# Altium schematic sheet ECU_Sheet2.SchDoc
size A3
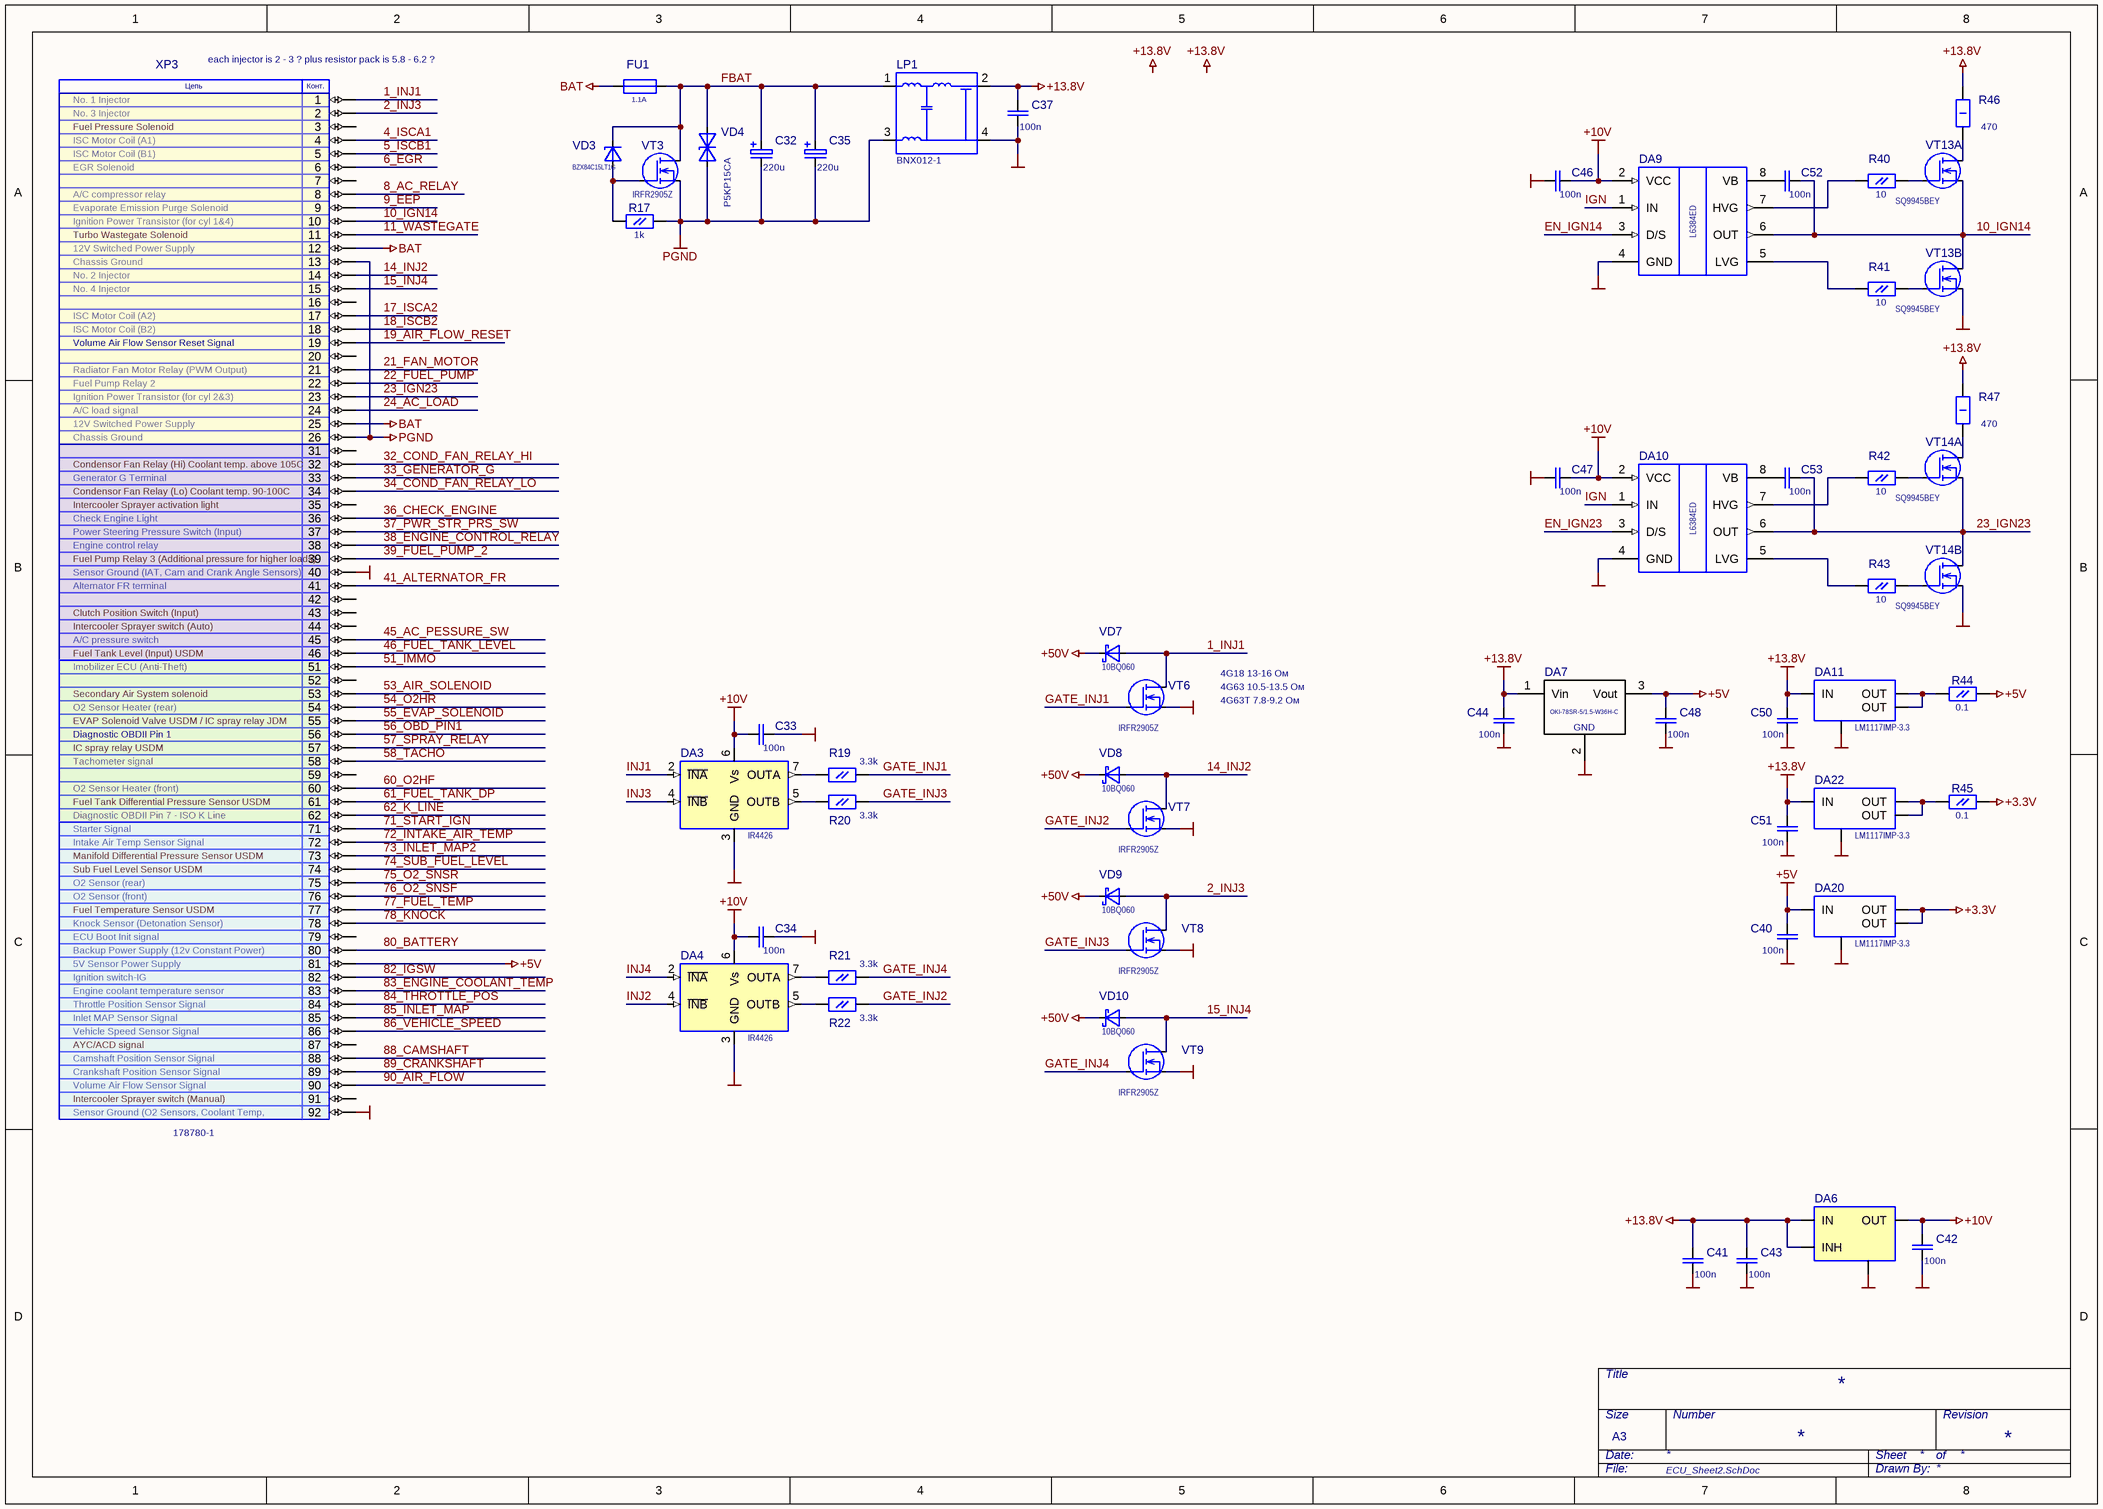
[diagram p0: ECU_Sheet2.SchDoc]

## Parts
C32  value 220u  [C_D_POL]  (hidden comment: CTANT)
C33  value 100n  [C0805L]  (hidden comment: CSMD)
C34  value 100n  [C0805L]  (hidden comment: CSMD)
C35  value 220u  [C_D_POL]  (hidden comment: CTANT)
C37  value 100n  [C0805L]  (hidden comment: 0.1мкФ-25В-X8R-10%)
C40  value 100n  [C0805L]  (hidden comment: CSMD)
C41  value 100n  [C0805L]  (hidden comment: 0.1мкФ-25В-X8R-10%)
C42  value 100n  [C0805L]  (hidden comment: 0.1мкФ-25В-X8R-10%)
C43  value 100n  [C0805L]  (hidden comment: 0.1мкФ-25В-X8R-10%)
C44  value 100n  [C0805L]  (hidden comment: CSMD)
C46  value 100n  [C0805L]  (hidden comment: CSMD)
C47  value 100n  [C0805L]  (hidden comment: CSMD)
C48  value 100n  [C0805L]  (hidden comment: CSMD)
C50  value 100n  [C0805L]  (hidden comment: CSMD)
C51  value 100n  [C0805L]  (hidden comment: CSMD)
C52  value 100n  [C0805L]  (hidden comment: CSMD)
C53  value 100n  [C0805L]  (hidden comment: CSMD)
DA3  IR4426  [SOIC8 JEDEC]
DA4  IR4426  [SOIC8 JEDEC]
DA6  TLE4266GS V10  [SOT-223]  (value not drawn)
DA7  OKI-78SR-5/1.5-W36H-C  [OKI-78SR-H]
DA9  L6384ED  [SOIC8 JEDEC]
DA10  L6384ED  [SOIC8 JEDEC]
DA11  LM1117IMP-3.3  [SOT-223]
DA20  LM1117IMP-3.3  [SOT-223]
DA22  LM1117IMP-3.3  [SOT-223]
FU1  value 1.1A  [FUSE1206]  (hidden comment: MF-NSMF110)
LP1  BNX012-1  [BNX012-01]
R17  value 1k  [R0805L]  (hidden comment: 1к-5%)
R19  value 3.3k  [R0603L]  (hidden comment: RSMD)
R20  value 3.3k  [R0603L]  (hidden comment: RSMD)
R21  value 3.3k  [R0603L]  (hidden comment: RSMD)
R22  value 3.3k  [R0603L]  (hidden comment: RSMD)
R40  value 10  [R0603L]  (hidden comment: RSMD)
R41  value 10  [R0603L]  (hidden comment: RSMD)
R42  value 10  [R0603L]  (hidden comment: RSMD)
R43  value 10  [R0603L]  (hidden comment: RSMD)
R44  value 0.1  [R0805L]  (hidden comment: 1к-5%)
R45  value 0.1  [R0805L]  (hidden comment: 1к-5%)
R46  value 470  [R2512]  (hidden comment: R2512)
R47  value 470  [R2512]  (hidden comment: R2512)
VD3  BZX84C15LT1G  [SOT-23]
VD4  P5KP15CA  [P600]
VD7  10BQ060  [DO-214AA SMB]
VD8  10BQ060  [DO-214AA SMB]
VD9  10BQ060  [DO-214AA SMB]
VD10  10BQ060  [DO-214AA SMB]
VT3  IRFR2905Z  [D-PAK (TO-252)]
VT6  IRFR2905Z  [D-PAK (TO-252)]
VT7  IRFR2905Z  [D-PAK (TO-252)]
VT8  IRFR2905Z  [D-PAK (TO-252)]
VT9  IRFR2905Z  [D-PAK (TO-252)]
VT13  SQ9945BEY  [SOIC8 DBL FET]  (parts A,B of 2)
VT14  SQ9945BEY  [SOIC8 DBL FET]  (parts A,B of 2)
XP3  178780-1  [MITSUBISHI_ECU_CON]

## Nets
+3.3V: DA20.2(OUT) DA20.4(OUT) R45.1(Pin1)
+5V: C40.1 C48.1 DA7.3(Vout) DA20.3(IN) R44.1(Pin1) XP3.81
+10V: C33.2 C34.2 C42.1 C46.1 C47.1 DA3.6(Vs) DA4.6(Vs) DA6.3(OUT) DA9.2(VCC) DA10.2(VCC)
+13.8V: C37.1 C41.1 C43.1 C44.1 C50.1 C51.1 DA6.1(IN) DA6.2(INH) DA7.1(Vin) DA11.3(IN) DA22.3(IN) LP1.2(CB) R46.2(Pin2) R47.2(Pin2)
+50V: VD7.2 VD8.2 VD9.2 VD10.2
BAT: FU1.1 XP3.12 XP3.25
GND: C33.1 C34.1 C37.2 C40.2 C41.2 C42.2 C43.2 C44.2 C46.2 C47.2 C48.2 C50.2 C51.2 DA3.3(GND) DA4.3(GND) DA6.4(GND) DA7.2 DA9.4(GND) DA10.4(GND) DA11.1(G) DA20.1(G) DA22.1(G) LP1.4(CG) VT6.2(S) VT7.2(S) VT8.2(S) VT9.2(S) VT13.3 VT14.3 XP3.40 XP3.92
PGND: C32.N C35.N LP1.3(PSG) R17.1(Pin1) VD4.1 VT3.2(S) XP3.13 XP3.26
1_INJ1: VD7.1 VT6.3(D) XP3.1
2_INJ3: VD9.1 VT8.3(D) XP3.2
4_ISCA1: XP3.4
5_ISCB1: XP3.5
6_EGR: XP3.6
8_AC_RELAY: XP3.8
9_EEP: XP3.9
10_IGN14: C52.1 DA9.6(OUT) VT13.1 VT13.5 XP3.10
11_WASTEGATE: XP3.11
14_INJ2: VD8.1 VT7.3(D) XP3.14
15_INJ4: VD10.1 VT9.3(D) XP3.15
17_ISCA2: XP3.17
18_ISCB2: XP3.18
19_AIR_FLOW_RESET: XP3.19
21_FAN_MOTOR: XP3.21
22_FUEL_PUMP: XP3.22
23_IGN23: C53.1 DA10.6(OUT) VT14.1 VT14.5 XP3.23
24_AC_LOAD: XP3.24
32_COND_FAN_RELAY_HI: XP3.32
33_GENERATOR_G: XP3.33
34_COND_FAN_RELAY_LO: XP3.34
36_CHECK_ENGINE: XP3.36
37_PWR_STR_PRS_SW: XP3.37
38_ENGINE_CONTROL_RELAY: XP3.38
39_FUEL_PUMP_2: XP3.39
41_ALTERNATOR_FR: XP3.41
45_AC_PESSURE_SW: XP3.45
46_FUEL_TANK_LEVEL: XP3.46
51_IMMO: XP3.51
53_AIR_SOLENOID: XP3.53
54_O2HR: XP3.54
55_EVAP_SOLENOID: XP3.55
56_OBD_PIN1: XP3.56
57_SPRAY_RELAY: XP3.57
58_TACHO: XP3.58
60_O2HF: XP3.60
61_FUEL_TANK_DP: XP3.61
62_K_LINE: XP3.62
71_START_IGN: XP3.71
72_INTAKE_AIR_TEMP: XP3.72
73_INLET_MAP2: XP3.73
74_SUB_FUEL_LEVEL: XP3.74
75_O2_SNSR: XP3.75
76_O2_SNSF: XP3.76
77_FUEL_TEMP: XP3.77
78_KNOCK: XP3.78
80_BATTERY: XP3.80
82_IGSW: XP3.82
83_ENGINE_COOLANT_TEMP: XP3.83
84_THROTTLE_POS: XP3.84
85_INLET_MAP: XP3.85
86_VEHICLE_SPEED: XP3.86
88_CAMSHAFT: XP3.88
89_CRANKSHAFT: XP3.89
90_AIR_FLOW: XP3.90
EN_IGN14: DA9.3(D/S)
EN_IGN23: DA10.3(D/S)
FBAT: C32.P C35.P FU1.2 LP1.1(B) VD3.3 VD4.2 VT3.3(D)
GATE_INJ1: R19.2(Pin2) VT6.1(G)
GATE_INJ2: R22.2(Pin2) VT7.1(G)
GATE_INJ3: R20.2(Pin2) VT8.1(G)
GATE_INJ4: R21.2(Pin2) VT9.1(G)
IGN: DA9.1(IN) DA10.1(IN)
INJ1: DA3.2(~{INA})
INJ2: DA4.4(~{INB})
INJ3: DA3.4(~{INB})
INJ4: DA4.2(~{INA})
NetC52_2: C52.2 DA9.8(VB)
NetC53_2: C53.2 DA10.8(VB)
NetDA3_5: DA3.5(OUTB) R20.1(Pin1)
NetDA3_7: DA3.7(OUTA) R19.1(Pin1)
NetDA4_5: DA4.5(OUTB) R22.1(Pin1)
NetDA4_7: DA4.7(OUTA) R21.1(Pin1)
NetDA9_5: DA9.5(LVG) R41.1(Pin1)
NetDA9_7: DA9.7(HVG) R40.1(Pin1)
NetDA10_5: DA10.5(LVG) R43.1(Pin1)
NetDA10_7: DA10.7(HVG) R42.1(Pin1)
NetDA11_2: DA11.2(OUT) DA11.4(OUT) R44.2(Pin2)
NetDA22_2: DA22.2(OUT) DA22.4(OUT) R45.2(Pin2)
NetR17_2: R17.2(Pin2) VD3.1 VT3.1(G)
NetR40_2: R40.2(Pin2) VT13.2
NetR41_2: R41.2(Pin2) VT13.4
NetR42_2: R42.2(Pin2) VT14.2
NetR43_2: R43.2(Pin2) VT14.4
NetR46_1: R46.1(Pin1) VT13.6
NetR47_1: R47.1(Pin1) VT14.6

Not connected (* = marked no-connect by the designer): LP1 5 6; XP3 3 7 16 20 31 35 42 43 44 52 59 79 87 91

## Notes on the sheet
- No. 1 Injector
- No. 3 Injector
- (near XP3) each injector is 2 - 3 ? plus resistor pack is 5.8 - 6.2 ?
- ISC Motor Coil (A1)
- ISC Motor Coil (B1)
- EGR Solenoid
- Fuel Pressure Solenoid
- A/C compressor relay
- Evaporate Emission Purge Solenoid
- Ignition Power Transistor (for cyl 1&4)
- 12V Switched Power Supply
- Turbo Wastegate Solenoid
- No. 2 Injector
- No. 4 Injector
- ISC Motor Coil (A2)
- Chassis Ground
- ISC Motor Coil (B2)
- Radiator Fan Motor Relay (PWM Output)
- Fuel Pump Relay 2
- Volume Air Flow Sensor Reset Signal
- Ignition Power Transistor (for cyl 2&3)
- A/C load signal
- Generator G Terminal
- Check Engine Light
- Intercooler Sprayer activation light
- (near XP3) Condensor Fan Relay (Lo) Coolant temp. 90-100C
- (near XP3) Condensor Fan Relay (Hi) Coolant temp. above 105C
- Power Steering Pressure Switch (Input)
- Engine control relay
- (near XP3) Sensor Ground (IAT, Cam and Crank Angle Sensors)
- Alternator FR terminal
- (near XP3) Fuel Pump Relay 3 (Additional pressure for higher loads)
- A/C pressure switch
- Fuel Tank Level (Input) USDM
- Intercooler Sprayer switch (Auto)
- Clutch Position Switch (Input)
- Imobilizer ECU (Anti-Theft)
- O2 Sensor Heater (rear)
- (near XP3) EVAP Solenoid Valve USDM / IC spray relay JDM
- Secondary Air System solenoid
- 4G18 13-16 Ом
- 4G63T 7.8-9.2 Ом
- 4G63 10.5-13.5 Ом
- Tachometer signal
- O2 Sensor Heater (front)
- Diagnostic OBDII Pin 1
- IC spray relay USDM
- Diagnostic OBDII Pin 7 - ISO K Line
- Starter Signal
- Intake Air Temp Sensor Signal
- (near XP3) Manifold Differential Pressure Sensor USDM
- (near XP3) Fuel Tank Differential Pressure Sensor USDM
- O2 Sensor (rear)
- O2 Sensor (front)
- Knock Sensor (Detonation Sensor)
- Fuel Temperature Sensor USDM
- Sub Fuel Level Sensor USDM
- ECU Boot Init signal
- Backup Power Supply (12v Constant Power)
- 5V Sensor Power Supply
- Ignition switch-IG
- Engine coolant temperature sensor
- Throttle Position Sensor Signal
- Inlet MAP Sensor Signal
- Vehicle Speed Sensor Signal
- Camshaft Position Sensor Signal
- AYC/ACD signal
- Volume Air Flow Sensor Signal
- Crankshaft Position Sensor Signal
- Sensor Ground (O2 Sensors, Coolant Temp,
- Intercooler Sprayer switch (Manual)
- Labels drawn without touching a wire or pin: +13.8V
- Title
- Date:
- Size
- A3
- Number
- Sheet
- of
- Revision
- File:
- Drawn By:
- (in symbol MITSUBISHI_ECU_CON) Цепь; Конт.
- (in symbol OKI-78SR) GND

## Library data of the parts
C32 C35 = CTANT: 220 mkF  25 v (корпус Е (4,4х7мм))  20% smd   Танталовый    ЧИП    227M025V; Part Field 1: *; Part Field 2: *
C33 C34 C37 C40-C44 C46-C48 C50-C53 = CSMD: C0603; Voltage: *; Part Field 1: *; Part Field 2: *
DA6 = TLE4266G: Value: *
DA7 = OKI-78SR: Fixed Output 1.5 Amp SIP DC/DC Converter
FU1 = MF-NSMF012
R17 R44 R45 = RSMD: R0805; Part Field 1: 0603; Part Field 2: *
R19-R22 R40-R43 = RSMD: R0805; Part Field 1: *; Part Field 2: *
VD3 = BZX84C36: Value: *
VT3 VT6-VT9 = SPD02N80C3: MOSFET 55V , 42A , 0.011 Om; OriginalName: 2N4124; ComponentField6: Published 8-Jun-2000, Modified 11-July-2000: SIM Model Added.; Value: *
XP3 = MITSUBISHI_ECU_CON: TE 178780-1; Value: *
DA3 DA4 = IR4426: Part Field 1: *; Part Field 2: *
DA11 DA20 DA22 = LM1117IMP-3.3: Value: *
LP1 = BNX012-1: Value: *
VD7-VD10 = 10BQ060: Value: *